# EAGLE design OmniLight (EAGLE 7.5.0)
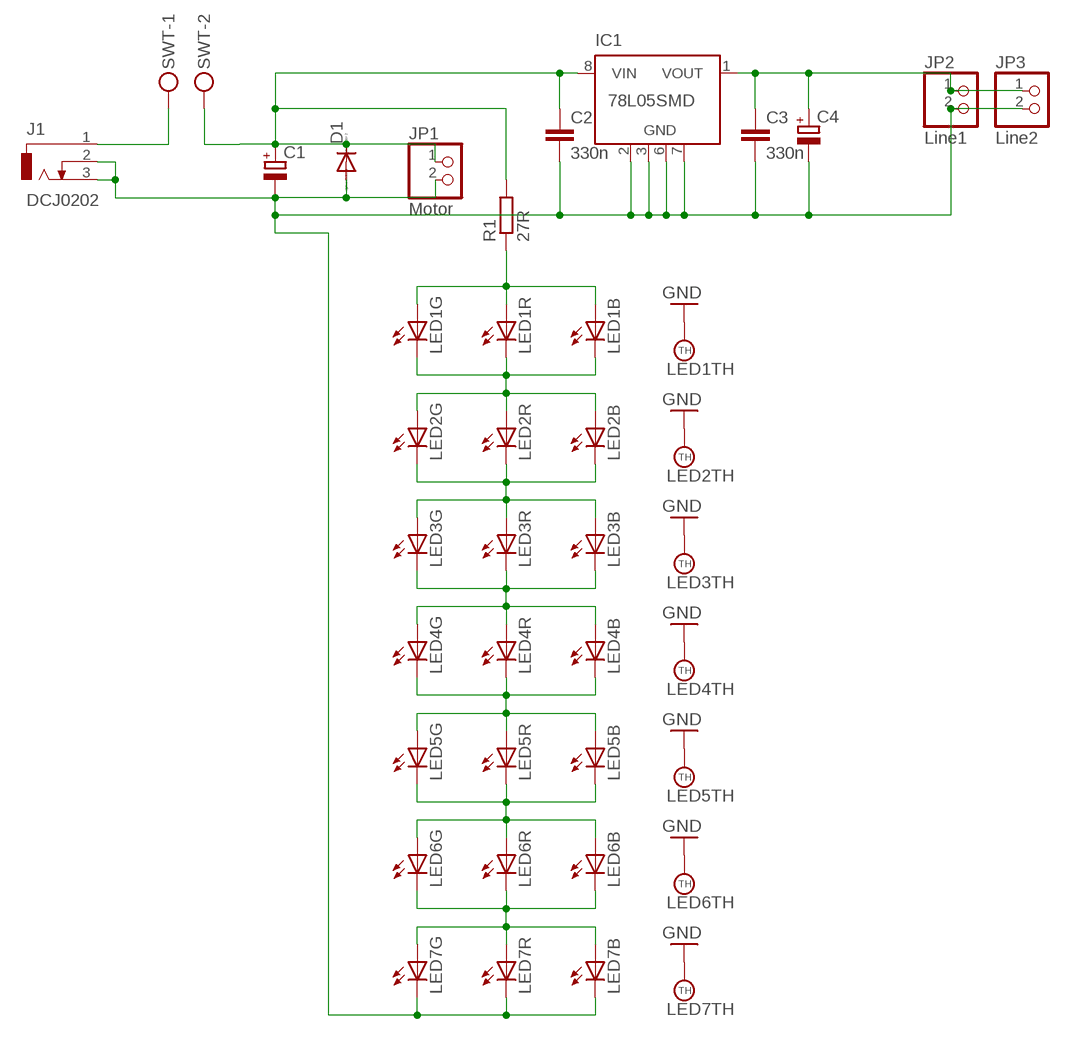
[diagram p0: schematic, sheet 1]

## Parts
C1  CPOL-EU140CLH-0810  [140CLH-0810]
C2  330n  C-EUC1206  [C1206]
C3  330n  C-EUC1206  [C1206]
C4  CPOL-EU140CLH-0810  [140CLH-0810]
D1  DIODE-DO214AC  [DO214AC]
IC1  78L05SMD  [SO08]
J1  DCJ0202  [DCJ0202]
JP1  Motor  PINHD-1X2  [1X02]
JP2  Line1  PINHD-1X2  [1X02]
JP3  Line2  PINHD-1X2  [1X02]
LED1  LP2C63-ST-RGB-SR0  [LP2C63-ST-RGB-SR0]
LED2  LP2C63-ST-RGB-SR0  [LP2C63-ST-RGB-SR0]
LED3  LP2C63-ST-RGB-SR0  [LP2C63-ST-RGB-SR0]
LED4  LP2C63-ST-RGB-SR0  [LP2C63-ST-RGB-SR0]
LED5  LP2C63-ST-RGB-SR0  [LP2C63-ST-RGB-SR0]
LED6  LP2C63-ST-RGB-SR0  [LP2C63-ST-RGB-SR0]
LED7  LP2C63-ST-RGB-SR0  [LP2C63-ST-RGB-SR0]
R1  27R  R-EU_R1206  [R1206]
SWT  MKDSN1,5/2-5,08  [MKDSN1,5/2-5,08]

## Nets
GND: LED1.TH(TH:TH) LED2.TH(TH:TH) LED3.TH(TH:TH) LED4.TH(TH:TH) LED5.TH(TH:TH) LED6.TH(TH:TH) LED7.TH(TH:TH)
N$1: LED1.1(G:A) LED1.2(R:A) LED1.3(B:A) R1.1
N$2: LED1.4(B:C) LED1.5(R:C) LED1.6(G:C) LED2.1(G:A) LED2.2(R:A) LED2.3(B:A)
N$3: J1.1 SWT.1
N$4: C1.+ C2.1 D1.C IC1.8(VIN) JP1.1 R1.2 SWT.2
N$5: LED2.4(B:C) LED2.5(R:C) LED2.6(G:C) LED3.1(G:A) LED3.2(R:A) LED3.3(B:A)
N$6: LED3.4(B:C) LED3.5(R:C) LED3.6(G:C) LED4.1(G:A) LED4.2(R:A) LED4.3(B:A)
N$7: C1.- C2.2 C3.2 C4.- D1.A IC1.2(GND) IC1.3(GND) IC1.6(GND) IC1.7(GND) J1.2 J1.3 JP1.2 JP2.2 JP3.2 LED7.4(B:C) LED7.5(R:C) LED7.6(G:C)
N$8: LED4.4(B:C) LED4.5(R:C) LED4.6(G:C) LED5.1(G:A) LED5.2(R:A) LED5.3(B:A)
N$10: LED5.4(B:C) LED5.5(R:C) LED5.6(G:C) LED6.1(G:A) LED6.2(R:A) LED6.3(B:A)
N$12: LED6.4(B:C) LED6.5(R:C) LED6.6(G:C) LED7.1(G:A) LED7.2(R:A) LED7.3(B:A)
N$13: C3.1 C4.+ IC1.1(VOUT) JP2.1 JP3.1
Unconnected: IC1.4(NC) IC1.5(NC)

## Library data of the parts
C1 C4 = rcl:CPOL-EU: POLARIZED CAPACITOR, European symbol
C2 C3 = rcl:C-EU: CAPACITOR, European symbol
D1 = diode:DIODE-: DIODE
IC1 = linear:78L*SMD: Positive VOLTAGE REGULATOR
J1 = con-jack:DCJ0202: DC POWER JACK Source: DCJ0202.pdf; OC_FARNELL: unknown; OC_NEWARK: unknown
JP1-JP3 = pinhead:PINHD-1X2: PIN HEADER
LED1-LED7 = led:LP2C63-ST-RGB-SR0: 1.5W RGB HIGH POWER LED Source: http://www.ledtech.com.tw .. LP2C63-ST-RGB-SR0.SPEC.pdf
R1 = rcl:R-EU_: RESISTOR, European symbol
SWT = con-phoenix-508:MKDSN1,5/2-5,08: MKDSN 1,5/ 2-5,08 Printklemme Nennstrom: 13,5 A Nennspannung: 250 V Rastermaß: 5,08 mm Polzahl: 2 Anschlussart: Schraubanschluss Montage: Löten Anschlussrichtung Leiter/Platine: 0 ° Artikelnummer: 1729128 Source: http://eshop.phoenixcontact.com .. 1729128.pdf

## Board
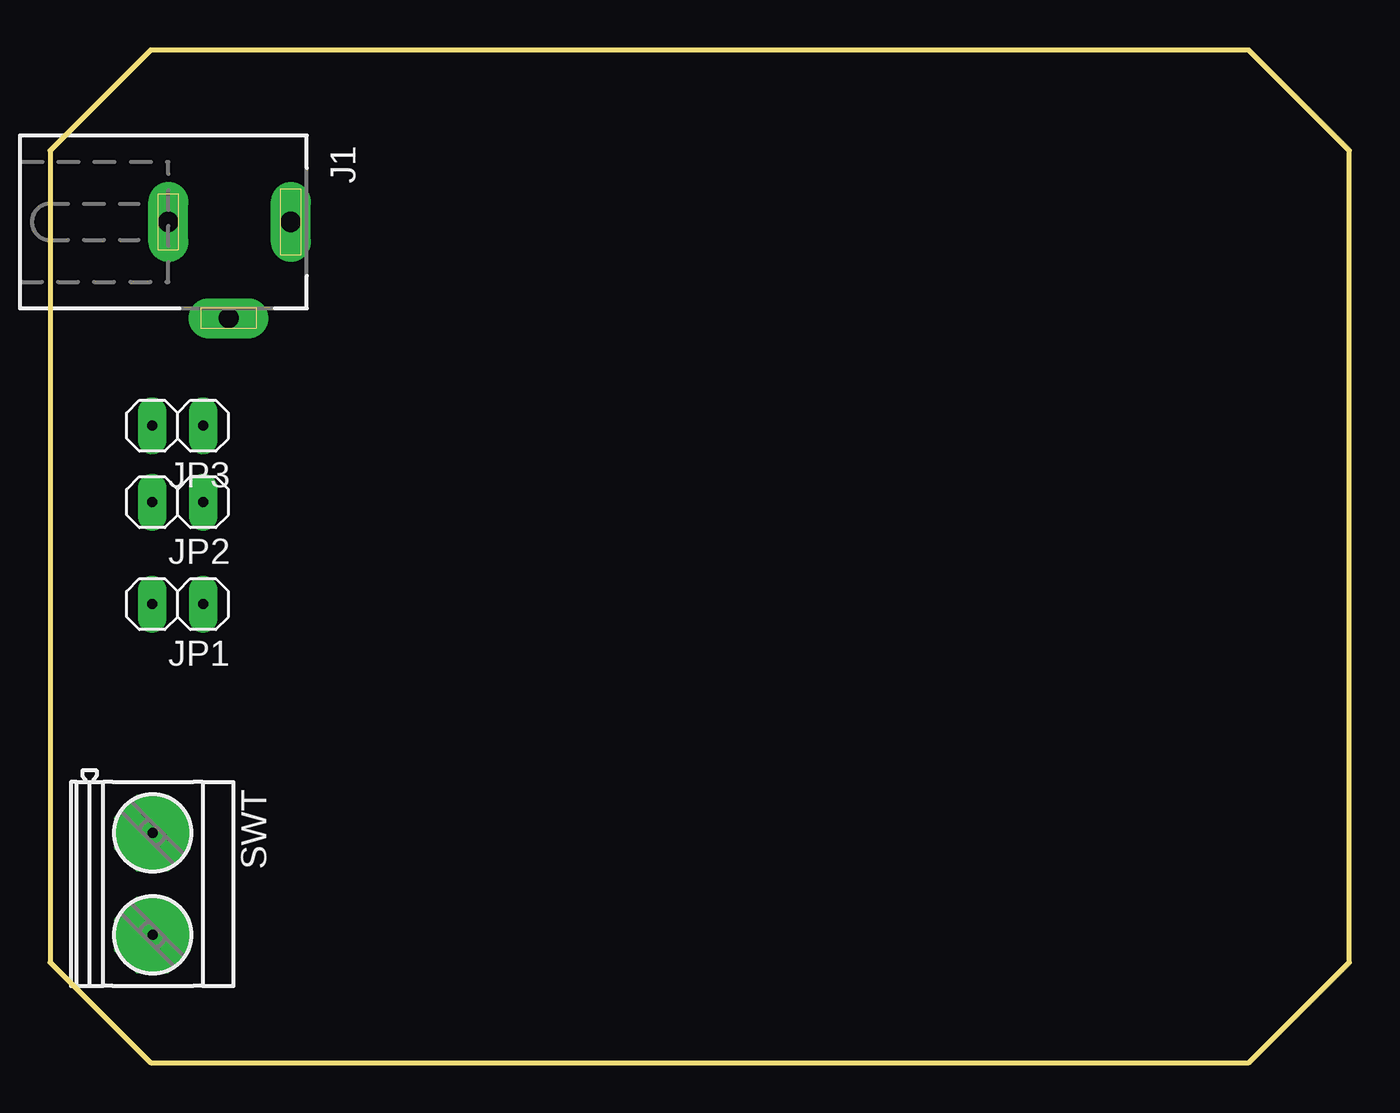
[diagram p1: board, top side]
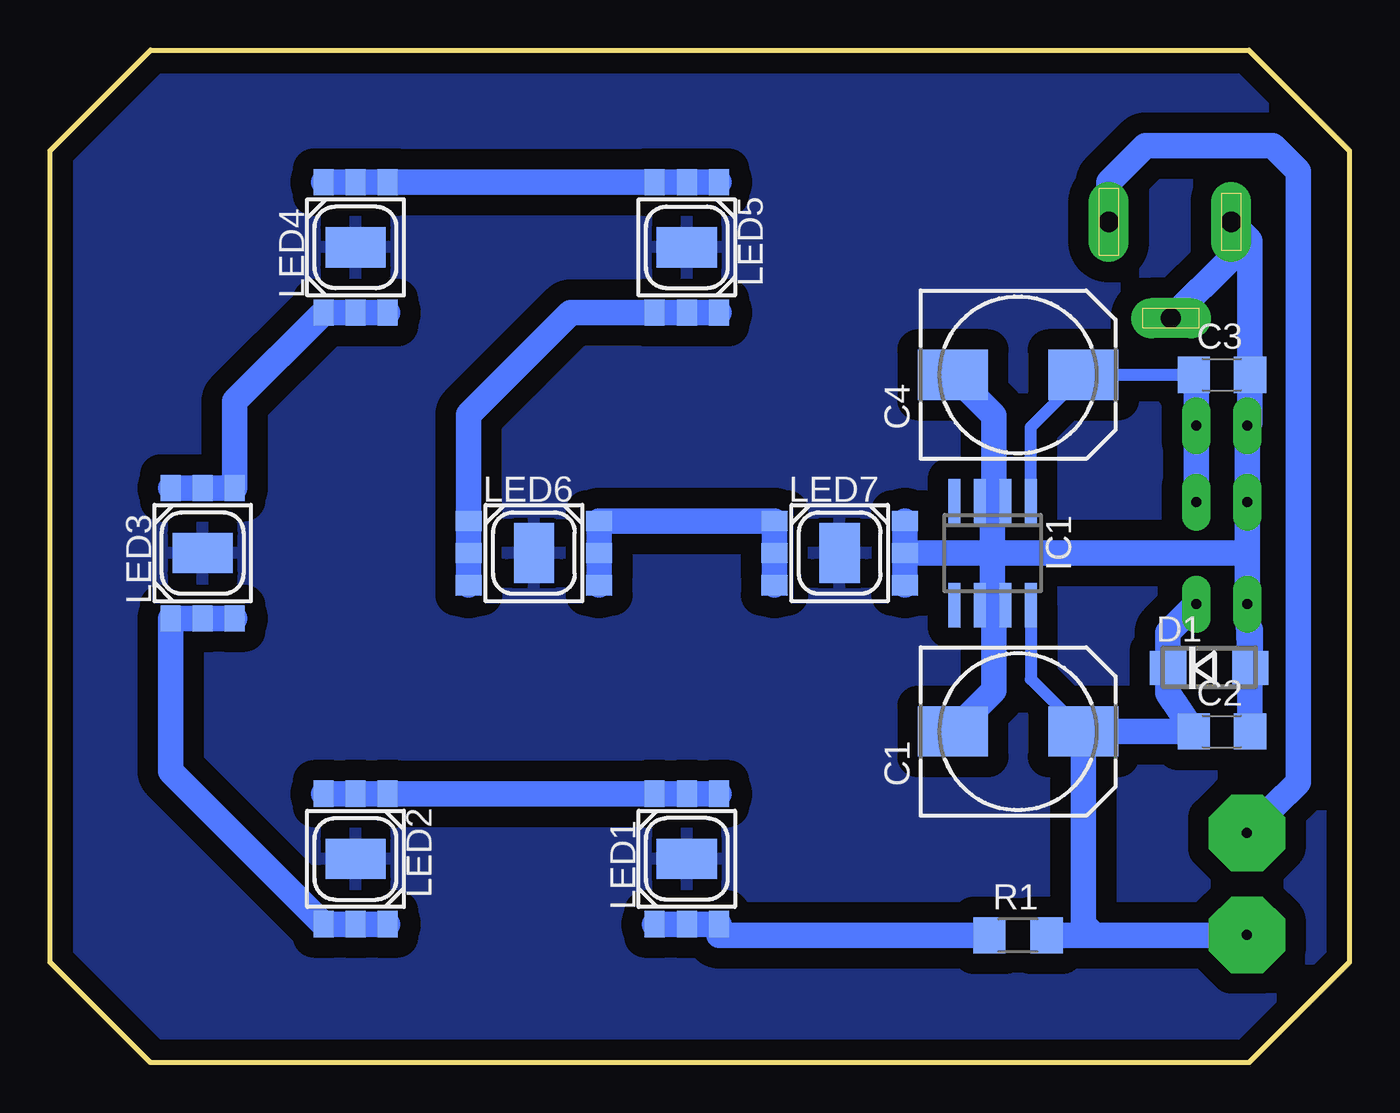
[diagram p2: board, bottom side, seen from below]

Size 64.75 x 50.47 mm. Coordinates in mm from the lower left corner, seen from the top.
Outline: 0,45.47 0,5 5,0 59.75,0 64.75,5 64.75,45.47 59.75,50.47 5,50.47 0,45.47
Copper layers (1*16): Top 0.035mm / dielectric 1.5mm / Bottom 0.035mm
Design rules "default": minimum track width 10mil, minimum drill 24mil, track to track 8mil, track to pad 8mil, pad to pad 8mil, via to via 8mil, smd to smd 8mil, copper to edge 40mil, drill to drill 8mil, minimum pad ring 10mil, minimum via ring 8mil, stop-mask expansion 4mil, vias tented up to drill 0mil, thermal gap 10mil

### Footprints (pad centres in the part's own frame; a part is rotated, then mirrored left to right if it is on the bottom)
140CLH-0810 = smd 3.5 x 2.5: + 3.25,0; - -3.25,0
C1206 = smd 1.6 x 1.8: 1 -1.4,0; 2 1.4,0
DO214AC = smd 1.8 x 1.7: A 2.05,0; C -2.05,0
SO08 = smd 0.6 x 2.2: 1 -1.905,-2.6; 2 -0.635,-2.6; 3 0.635,-2.6; 4 1.905,-2.6; 5 1.905,2.6; 6 0.635,2.6; 7 -0.635,2.6; 8 -1.905,2.6
DCJ0202 = drill 1 pad 2 long: 1 0,3.1; 2 4.8,0; 3 0,-3
1X02 = drill 0.5 pad 1.422 long: 1 -1.27,0; 2 1.27,0
LP2C63-ST-RGB-SR0 = smd 1.3 x 1: 1 -3.25,1.6; 2 -3.25,0; 3 -3.25,-1.6; 4 3.25,-1.6; 5 3.25,0; 6 3.25,1.6 | smd 2 x 3: TH 0,0
R1206 = smd 1.6 x 1.803: 1 -1.422,0; 2 1.422,0
MKDSN1,5/2-5,08 = drill 0.5 pad 3.81 octagon: 1 -2.561,0.025; 2 2.519,0.025

### Placement (x,y rotation side)
C1  16.51,16.51 0 bottom
C2  6.35,16.51 0 bottom
C3  6.35,34.29 0 bottom
C4  16.51,34.29 0 bottom
D1  6.98,19.68 0 bottom
IC1  17.78,25.4 180 bottom
J1  8.89,41.91 270 top
JP1  6.35,22.86 180 top
JP2  6.35,27.94 180 top
JP3  6.35,31.75 180 top
LED1  33.02,10.16 90 bottom
LED2  49.53,10.16 270 bottom
LED3  57.15,25.4 90 bottom
LED4  49.53,40.64 90 bottom
LED5  33.02,40.64 270 bottom
LED6  40.64,25.4 0 bottom
LED7  25.4,25.4 0 bottom
R1  16.51,6.35 0 bottom
SWT  5.08,8.89 270 top

### Tracks (layer width: path | path; a pad name or v marks a point on that pad's centre or on a via)
GND
  pour Bottom (isolate 1.016): 0,5.08 5.08,0 59.69,0 64.77,5.08 64.77,45.72 59.69,50.8 5.08,50.8 0,45.72
N$1
  Bottom 1.27: LED1.1 LED1.2 LED1.3 31.42,6.35 R1.1
N$2
  Bottom 1.27: LED1.4 LED1.5 LED1.6 LED2.1 LED2.2 LED2.3
N$3
  Bottom 1.27: J1.1 11.99,43.89 10.16,45.72 5.08,45.72 3.81,45.72 2.54,44.45 2.54,38.1 2.54,13.97 5.08,11.48 SWT.1
N$4
  Bottom 0.61: IC1.8 15.88,22.23 15.88,19.12 C1.+
  Bottom 1.27: 12.7,6.35 10.16,6.35 5.13,6.35 SWT.2 | 7.88,16.38 C2.1 | 12.7,6.35 13.26,6.91 C1.+ 9.02,16.51 C2.1 | 12.7,6.35 R1.2 | C2.1 9.04,18.43 D1.C 9.04,21.45 JP1.1
N$5
  Bottom 1.27: LED2.6 LED2.5 LED2.4 58.75,14.53 LED3.1 LED3.2 LED3.3
N$6
  Bottom 1.27: LED3.6 LED3.5 LED3.4 55.55,32.97 LED4.1 LED4.2 LED4.3
N$7
  Bottom 0.406: IC1.6 17.84,22.8 17.78,22.86 17.72,22.8 IC1.7 | IC1.3 17.84,28 17.78,27.94 17.72,28 IC1.2
  Bottom 1.27: LED7.6 LED7.5 | LED7.5 LED7.4 | 8.89,36.83 J1.2 5.89,40.11 J1.3 5.48,41.51 | 17.78,27.94 17.78,25.4 | 17.78,25.4 5.08,25.4 | 17.78,22.86 17.78,25.4 | 17.78,25.4 20.32,25.4 LED7.5 | C2.2 4.95,20.19 4.96,20.33 | 4.96,20.33 JP1.2 5.08,25.4 | C4.- 17.72,32.25 17.72,28 | 5.08,41.1 5.48,41.51 | 5.08,25.4 JP2.2 JP3.2 4.95,31.88 C3.2 4.95,40.97 5.48,41.51 | 17.72,22.8 17.72,18.55 C1.- | D1.A 4.94,21.6 4.96,20.33
N$8
  Bottom 1.27: LED4.6 LED4.5 LED4.4 LED5.3 LED5.2 LED5.1
N$10
  Bottom 1.27: LED5.6 LED5.5 LED5.4 38.81,37.39 39.37,36.83 43.89,32.31 LED6.1 LED6.2 LED6.3
N$12
  Bottom 1.27: LED6.4 LED6.5 LED6.6 LED7.1 LED7.2 LED7.3
N$13
  Bottom 0.61: IC1.1 15.88,31.68 C4.+ C3.1
  Bottom 1.27: JP2.1 JP3.1 7.62,34.16 C3.1